# EAGLE design relay (EAGLE 9.6.2)
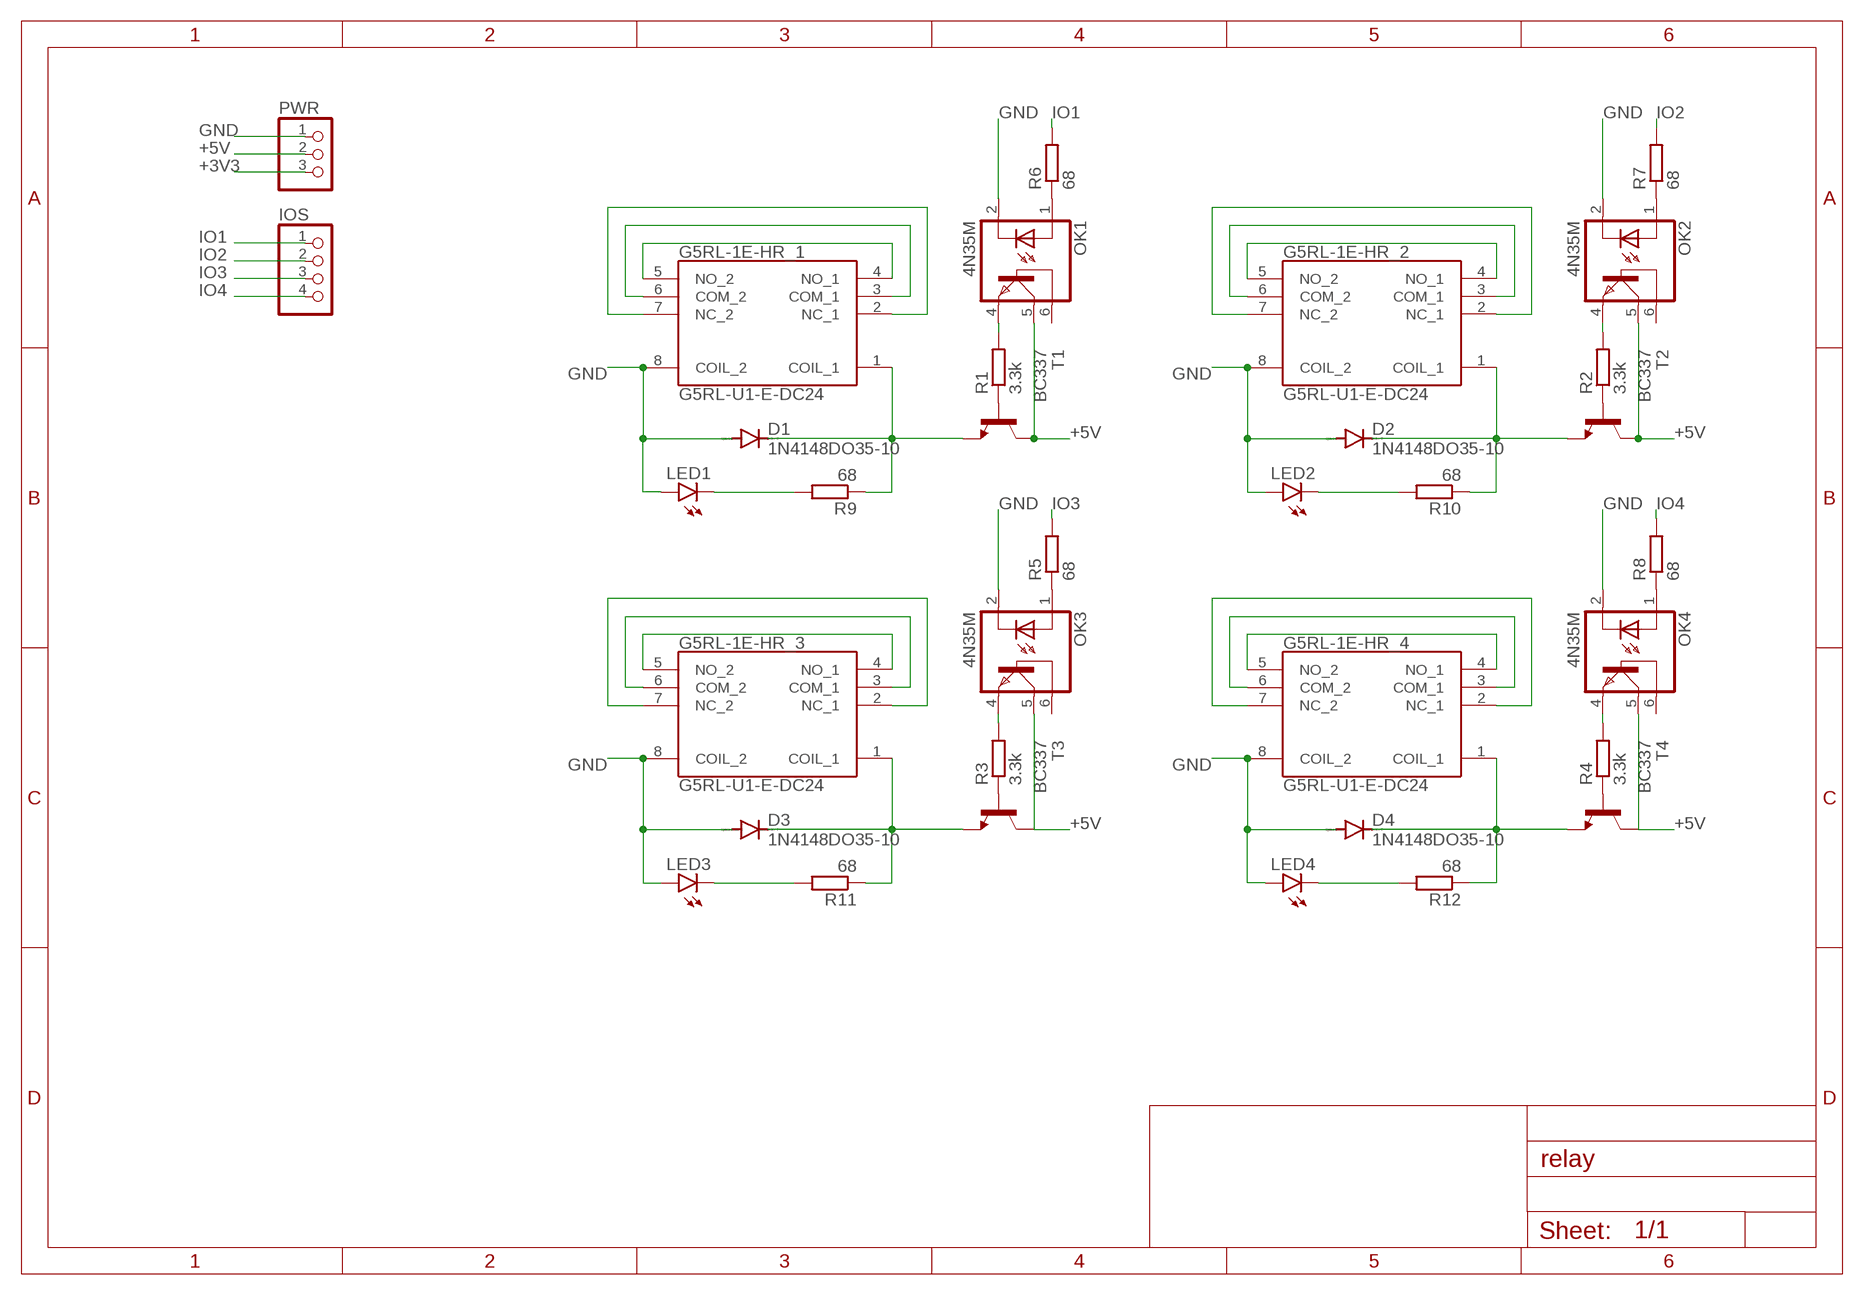
[diagram p0: schematic, sheet 1]

## Parts
D1  1N4148DO35-10  [DO35-10]
D2  1N4148DO35-10  [DO35-10]
D3  1N4148DO35-10  [DO35-10]
D4  1N4148DO35-10  [DO35-10]
G5RL-1E-HR_1  G5RL-U1-E-DC24  [G5RLU1EDC24]
G5RL-1E-HR_2  G5RL-U1-E-DC24  [G5RLU1EDC24]
G5RL-1E-HR_3  G5RL-U1-E-DC24  [G5RLU1EDC24]
G5RL-1E-HR_4  G5RL-U1-E-DC24  [G5RLU1EDC24]
IOS  PINHD-1X4  [1X04]
LED1  LED3MM  [LED3MM]
LED2  LED3MM  [LED3MM]
LED3  LED3MM  [LED3MM]
LED4  LED3MM  [LED3MM]
OK1  4N35M  [DIL06]
OK2  4N35M  [DIL06]
OK3  4N35M  [DIL06]
OK4  4N35M  [DIL06]
PWR  PINHD-1X3  [1X03]
R1  3.3k  R-EU_0207/7  [0207/7]
R2  3.3k  R-EU_0207/7  [0207/7]
R3  3.3k  R-EU_0207/7  [0207/7]
R4  3.3k  R-EU_0207/7  [0207/7]
R5  68  R-EU_0204/7  [0204/7]
R6  68  R-EU_0204/7  [0204/7]
R7  68  R-EU_0204/7  [0204/7]
R8  68  R-EU_0204/7  [0204/7]
R9  68  R-EU_0204/7  [0204/7]
R10  68  R-EU_0204/7  [0204/7]
R11  68  R-EU_0204/7  [0204/7]
R12  68  R-EU_0204/7  [0204/7]
T1  BC337  [TO92@1]
T2  BC337  [TO92@1]
T3  BC337  [TO92@1]
T4  BC337  [TO92@1]

## Nets
+3V3: PWR.3
+5V: OK1.5(COL) OK2.5(COL) OK3.5(COL) OK4.5(COL) PWR.2 T1.3(C) T2.3(C) T3.3(C) T4.3(C)
GND: D1.A D2.A D3.A D4.A G5RL-1E-HR_1.8(COIL_2) G5RL-1E-HR_2.8(COIL_2) G5RL-1E-HR_3.8(COIL_2) G5RL-1E-HR_4.8(COIL_2) LED1.A LED2.A LED3.A LED4.A OK1.2(C) OK2.2(C) OK3.2(C) OK4.2(C) PWR.1
IO1: IOS.1 R6.2
IO2: IOS.2 R7.2
IO3: IOS.3 R5.2
IO4: IOS.4 R8.2
N$1: G5RL-1E-HR_1.4(NO_1) G5RL-1E-HR_1.5(NO_2)
N$2: G5RL-1E-HR_1.3(COM_1) G5RL-1E-HR_1.6(COM_2)
N$3: G5RL-1E-HR_1.2(NC_1) G5RL-1E-HR_1.7(NC_2)
N$4: OK1.4(EMI) R1.2
N$5: D1.C G5RL-1E-HR_1.1(COIL_1) R9.1 T1.1(E)
N$6: R1.1 T1.2(B)
N$7: G5RL-1E-HR_2.4(NO_1) G5RL-1E-HR_2.5(NO_2)
N$8: G5RL-1E-HR_2.3(COM_1) G5RL-1E-HR_2.6(COM_2)
N$9: G5RL-1E-HR_2.2(NC_1) G5RL-1E-HR_2.7(NC_2)
N$10: OK1.1(A) R6.1
N$11: D2.C G5RL-1E-HR_2.1(COIL_1) R10.1 T2.1(E)
N$12: R2.1 T2.2(B)
N$13: G5RL-1E-HR_3.4(NO_1) G5RL-1E-HR_3.5(NO_2)
N$14: G5RL-1E-HR_3.3(COM_1) G5RL-1E-HR_3.6(COM_2)
N$15: G5RL-1E-HR_3.2(NC_1) G5RL-1E-HR_3.7(NC_2)
N$16: OK3.4(EMI) R3.2
N$17: D3.C G5RL-1E-HR_3.1(COIL_1) R11.1 T3.1(E)
N$18: R3.1 T3.2(B)
N$19: G5RL-1E-HR_4.4(NO_1) G5RL-1E-HR_4.5(NO_2)
N$20: G5RL-1E-HR_4.3(COM_1) G5RL-1E-HR_4.6(COM_2)
N$21: G5RL-1E-HR_4.2(NC_1) G5RL-1E-HR_4.7(NC_2)
N$22: OK3.1(A) R5.1
N$23: D4.C G5RL-1E-HR_4.1(COIL_1) R12.1 T4.1(E)
N$24: R4.1 T4.2(B)
N$25: OK4.4(EMI) R4.2
N$26: OK2.4(EMI) R2.2
N$27: OK2.1(A) R7.1
N$28: OK4.1(A) R8.1
N$29: LED1.K(C) R9.2
N$30: LED3.K(C) R11.2
N$31: LED2.K(C) R10.2
N$32: LED4.K(C) R12.2
Unconnected: OK1.6(BAS) OK2.6(BAS) OK3.6(BAS) OK4.6(BAS)

## Library data of the parts
D1-D4 = diode:1N4148: DIODE high speed (Philips)
G5RL-1E-HR_1-G5RL-1E-HR_4 = G5RL-U1-E-DC24:G5RL-U1-E-DC24: General Purpose Relays 16A hi swtch curent latching relay Source: Datasheet <https://componentsearchengine.com/Datasheets/1/G5RL-U1-E-DC24.pdf>; DESCRIPTION: General Purpose Relays 16A hi swtch curent latching relay; HEIGHT: 15.7mm; MANUFACTURER_NAME: Omron Electronics; MANUFACTURER_PART_NUMBER: G5RL-U1-E-DC24; MOUSER_PART_NUMBER: 653-G5RLU1EDC24; MOUSER_PRICE-STOCK: https://www.mouser.co.uk/ProductDetail/Omron-Electronics/G5RL-U1-E-DC24?qs=9CM3gX%252B2VGFmWjTQsGY23w%3D%3D
IOS = pinhead:PINHD-1X4: PIN HEADER
LED1-LED4 = led:LED: LED OSRAM: - CHIPLED LG R971, LG N971, LY N971, LG Q971, LY Q971, LO R971, LY R971 LH N974, LH R974 LS Q976, LO Q976, LY Q976 LO Q996 - Hyper CHIPLED LW Q18S LB Q993, LB Q99A, LB R99A - SideLED LS A670, LO A670, LY A670, LG A670, LP A670 LB A673, LV A673, LT A673, LW A673 LH A674 LY A675 LS A676, LA A676, LO A676, LY A676, LW A676 LS A679, LY A679, LG A679 - Hyper Micro SIDELED® LS Y876, LA Y876, LO Y876, LY Y876 LT Y87S - SmartLED LW L88C, LW L88S LB L89C, LB L89S, LG L890 LS L89K, LO L89K, LY L89K LS L896, LA L896, LO L896, LY L896 - TOPLED LS T670, LO T670, LY T670, LG T670, LP T670 LSG T670, LSP T670, LSY T670, LOP T670, LYG T670 LG T671, LOG T671, LSG T671 LB T673, LV T673, LT T673, LW T673 LH T674 LS T676, LA T676, LO T676, LY T676, LB T676, LH T676, LSB T676, LW T676 LB T67C, LV T67C, LT T67C, LS T67K, LO T67K, LY T67K, LW E67C LS E67B, LA E67B, LO E67B, LY E67B, LB E67C, LV E67C, LT E67C LW T67C LS T679, LY T679, LG T679 LS T770, LO T770, LY T770, LG T770, LP T770 LB T773, LV T773, LT T773, LW T773 LH T774 LS E675, LA E675, LY E675, LS T675 LS T776, LA T776, LO T776, LY T776, LB T776 LHGB T686 LT T68C, LB T68C - Hyper Mini TOPLED® LB M676 - Mini TOPLED Santana® LG M470 LS M47K, LO M47K, LY M47K Source: http://www.osram.convergy.de LUXEON: - LUMILED® LXK2-PW12-R00, LXK2-PW12-S00, LXK2-PW14-U00, LXK2-PW14-V00 LXK2-PM12-R00, LXK2-PM12-S00, LXK2-PM14-U00 LXK2-PE12-Q00, LXK2-PE12-R00, LXK2-PE12-S00, LXK2-PE14-T00, LXK2-PE14-U00 LXK2-PB12-K00, LXK2-PB12-L00, LXK2-PB12-M00, LXK2-PB14-N00, LXK2-PB14-P00, LXK2-PB14-Q00 LXK2-PR12-L00, LXK2-PR12-M00, LXK2-PR14-Q00, LXK2-PR14-R00 LXK2-PD12-Q00, LXK2-PD12-R00, LXK2-PD12-S00 LXK2-PH12-R00, LXK2-PH12-S00 LXK2-PL12-P00, LXK2-PL12-Q00, LXK2-PL12-R00 Source: www.luxeon.com KINGBRIGHT: KA-3528ASYC Source: www.kingbright.com
OK1-OK4 = optocoupler:4N*?M: General Purpose 6-Pin Phototransistor Optocouplers Source: http://www.fairchildsemi.com/ds/4N/4N35-M.pdf; MPN: 4N35-M; OC_FARNELL: 1021351; OC_NEWARK: 98K9114
PWR = pinhead:PINHD-1X3: PIN HEADER
R1-R12 = resistor:R-EU_: RESISTOR, European symbol
T1-T4 = transistor:BC337: NPN TRANSISTOR

## Board
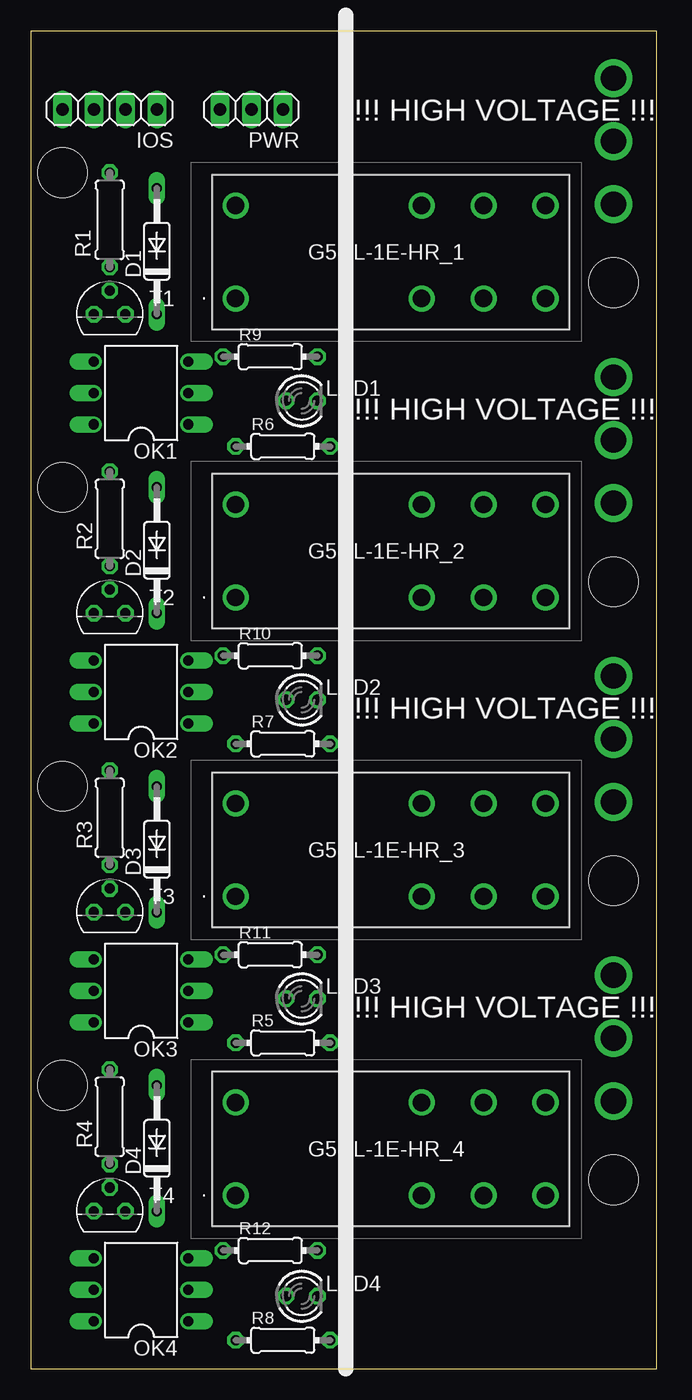
[diagram p1: board, top side]
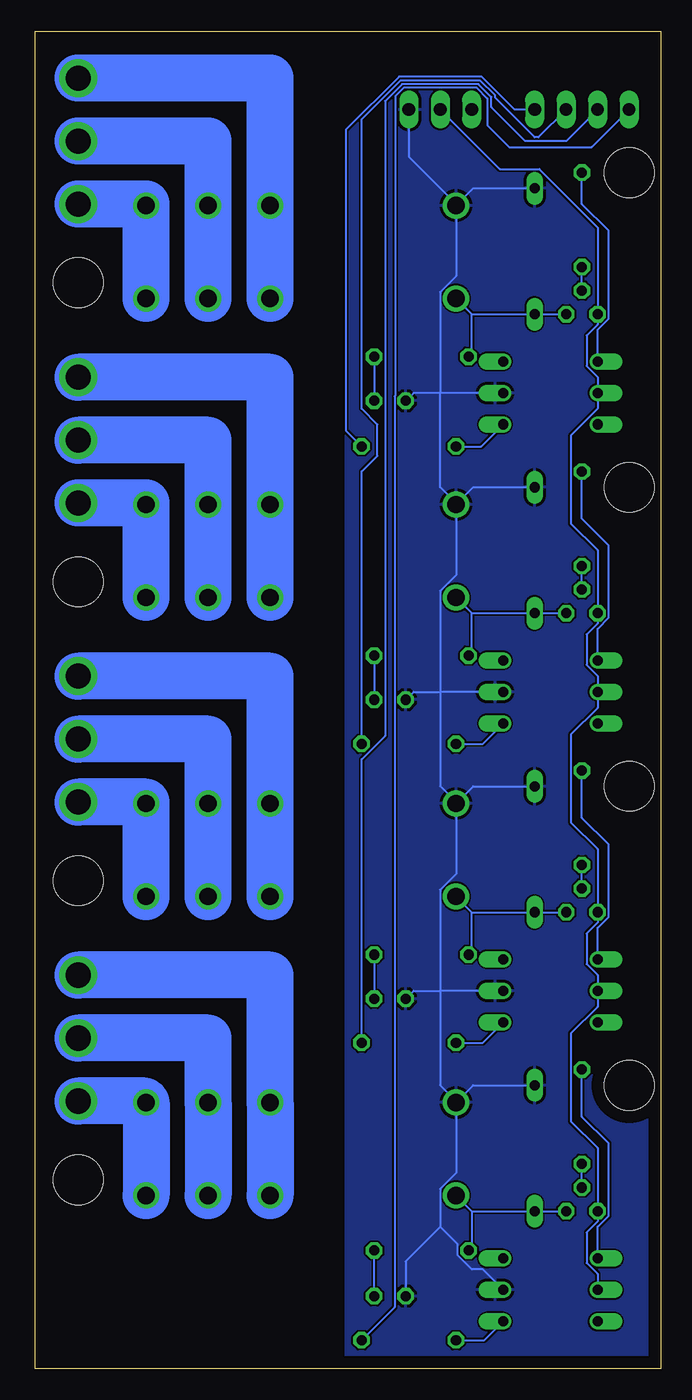
[diagram p2: board, bottom side, seen from below]

Size 50.47 x 107.94 mm. Coordinates in mm from the lower left corner, seen from the top.
Outline: 0,0 50.47,0 50.47,107.94 0,107.94 0,0
Copper layers (1*16): Top 0.035mm / dielectric 1.5mm / Bottom 0.035mm
Design rules "default": minimum track width 6mil, minimum drill 0.35mm, track to track 6mil, track to pad 6mil, pad to pad 6mil, via to via 6mil, smd to smd 6mil, copper to edge 40mil, drill to drill 6mil, minimum pad ring 10mil, minimum via ring 8mil, stop-mask expansion 4mil, vias tented up to drill 0mil, thermal gap 10mil
Holes 4 mm at 46.99,87.63 46.99,63.5 46.99,39.37 46.99,15.24 2.54,71.12 2.54,46.99 2.54,22.86 2.54,96.52

### Footprints (pad centres in the part's own frame; a part is rotated, then mirrored left to right if it is on the bottom)
DO35-10 = drill 0.813 long: A 5.08,0; C -5.08,0
G5RLU1EDC24 = drill 1.4 pad 2.1: 1 0,0; 2 15,0; 3 20,0; 4 25,0; 5 25,7.5; 6 20,7.5; 7 15,7.5; 8 0,7.5
1X04 = drill 1.016 long: 1 -3.81,0; 2 -1.27,0; 3 1.27,0; 4 3.81,0
LED3MM = drill 0.813 octagon: A -1.27,0; K 1.27,0
DIL06 = drill 0.813 offset: 1 -2.54,-3.81; 2 0,-3.81; 3 2.54,-3.81; 4 2.54,3.81; 5 0,3.81; 6 -2.54,3.81
1X03 = drill 1.016 long: 1 -2.54,0; 2 0,0; 3 2.54,0
0207/7 = drill 0.813 octagon: 1 -3.81,0; 2 3.81,0
0204/7 = drill 0.813 octagon: 1 -3.81,0; 2 3.81,0
TO92@1 = drill 0.813 octagon: 1 1.27,0; 2 0,1.905; 3 -1.27,0

### Placement (x,y rotation side)
D1  10.16,90.17 90 top
D2  10.16,66.04 90 top
D3  10.16,41.91 90 top
D4  10.16,17.78 90 top
G5RL-1E-HR_1  16.51,86.36 0 top
G5RL-1E-HR_2  16.51,62.23 0 top
G5RL-1E-HR_3  16.51,38.1 0 top
G5RL-1E-HR_4  16.51,13.97 0 top
IOS  6.35,101.6 180 top
LED1  21.84,78.11 0 top
LED2  21.84,53.98 0 top
LED3  21.84,29.84 0 top
LED4  21.84,5.84 0 top
OK1  8.89,78.74 90 top
OK2  8.89,54.61 90 top
OK3  8.89,30.48 90 top
OK4  8.89,6.35 90 top
PWR  17.78,101.6 180 top
R1  6.35,92.71 90 top
R2  6.35,68.58 90 top
R3  6.35,44.45 90 top
R4  6.35,20.32 90 top
R5  20.32,26.29 0 top
R6  20.32,74.42 0 top
R7  20.32,50.42 0 top
R8  20.32,2.29 0 top
R9  19.3,81.66 0 top
R10  19.3,57.53 0 top
R11  19.3,33.4 0 top
R12  19.3,9.53 0 top
T1  6.35,85.09 0 top
T2  6.35,60.96 0 top
T3  6.35,36.83 0 top
T4  6.35,12.7 0 top

### Tracks (layer width: path | path; a pad name or v marks a point on that pad's centre or on a via)
+5V
  Bottom 0.152: OK4.5 5.08,7.63 5.97,8.52 5.97,10.99 5.08,11.87 T4.3 5.08,17.79 7.24,19.95 7.24,27.04 5.08,29.2 OK3.5 5.08,31.76 5.97,32.65 5.97,35.12 5.08,36 T3.3 5.08,41.92 7.24,44.08 7.24,51.17 5.08,53.33 OK2.5 5.08,55.89 5.97,56.78 5.97,59.24 5.08,60.13 T2.3 5.08,66.05 7.24,68.21 7.24,75.3 5.08,77.46 OK1.5 5.08,80.02 5.97,80.91 5.97,83.38 5.08,84.26 T1.3 5.08,92.09 9.79,96.8 12.98,96.8 PWR.2
GND
  Bottom 0.152: 16.45,93.92 G5RL-1E-HR_1.8 16.51,88.17 17.79,86.89 17.79,78.74 | 16.45,93.92 15.12,95.25 D1.A | 16.45,69.79 G5RL-1E-HR_2.8 16.51,64.04 17.79,62.76 17.79,54.61 | 16.45,69.79 15.12,71.12 D2.A | 16.45,45.66 G5RL-1E-HR_3.8 16.51,39.91 17.79,38.63 17.79,30.48 | 16.45,45.66 15.12,46.99 D3.A | 16.45,21.53 G5RL-1E-HR_4.8 16.51,15.78 17.79,14.5 17.79,11.43 | 16.45,21.53 15.12,22.86 D4.A | PWR.1 20.32,97.79 16.45,93.92 | 17.79,78.74 17.79,71.13 16.45,69.79 | 17.79,54.61 17.79,47 16.45,45.66 | OK1.2 17.79,78.74 | OK2.2 17.79,54.61 | OK3.2 17.79,30.48 | 17.79,11.43 17.79,11.4 | 17.79,78.74 19.94,78.74 LED1.A | LED2.A 19.94,54.61 17.79,54.61 | OK4.2 14.35,8 15.23,8 16.38,9.16 16.38,10.02 17.79,11.43 | 17.79,11.43 20.57,8.64 LED4.A | LED3.A 19.94,30.48 17.79,30.48 | 16.45,21.53 17.79,22.87 17.79,30.48
  pour Bottom: 0,107.95 0,0 25.4,0 25.4,107.95
IO1
  Bottom 0.152: IOS.1 11.78,101.6 14.45,104.27 21.11,104.27 25.4,99.98 25.4,75.69 R6.2
IO2
  Bottom 0.152: IOS.2 9.86,99.37 10.16,99.37 13.36,102.57 13.36,102.75 14.58,103.96 20.98,103.96 24.13,100.82 24.13,77.47 22.86,76.2 22.86,73.66 24.13,72.39 R7.2
IO3
  Bottom 0.152: IOS.3 7.62,99.06 10.92,99.06 13.66,101.8 13.66,102.62 14.7,103.66 20.86,103.66 22.22,102.29 22.22,51.07 24.13,49.16 R5.2
IO4
  Bottom 0.152: IOS.4 5.56,98.58 12.22,98.58 13.97,100.33 13.97,102.49 14.83,103.35 20.73,103.35 21.4,102.68 21.4,78.54 21.46,78.47 21.46,4.95 R8.2
N$1  (via drill 2.03)
  Bottom 3.81: G5RL-1E-HR_1.4 G5RL-1E-HR_1.5 41.51,93.98 v46.99,93.98
N$2  (via drill 2.03)
  Bottom 3.81: G5RL-1E-HR_1.3 G5RL-1E-HR_1.6 36.51,99.06 v46.99,99.06
N$3  (via drill 2.03)
  Bottom 3.81: G5RL-1E-HR_1.2 G5RL-1E-HR_1.7 31.51,104.14 v46.99,104.14
N$4
  Bottom 0.152: OK1.4 5.08,83.83 4.19,84.72 4.19,91.82 6.35,93.98 R1.2
N$5
  Bottom 0.152: G5RL-1E-HR_1.1 15.24,85.09 | 15.24,85.09 D1.C T1.1 | R9.1 15.24,81.92 15.24,85.09
N$6
  Bottom 0.152: T1.2 R1.1
N$7  (via drill 2.03)
  Bottom 3.81: G5RL-1E-HR_2.4 G5RL-1E-HR_2.5 41.51,69.85 v46.99,69.85
N$8  (via drill 2.03)
  Bottom 3.81: G5RL-1E-HR_2.3 G5RL-1E-HR_2.6 36.51,74.93 v46.99,74.93
N$9  (via drill 2.03)
  Bottom 3.81: G5RL-1E-HR_2.2 G5RL-1E-HR_2.7 31.51,80.01 v46.99,80.01
N$10
  Bottom 0.152: R6.1 14.48,74.42 OK1.1
N$11
  Bottom 0.152: G5RL-1E-HR_2.1 15.24,60.96 | 15.24,60.96 D2.C T2.1 | R10.1 15.24,57.79 15.24,60.96
N$12
  Bottom 0.152: T2.2 R2.1
N$13  (via drill 2.03)
  Bottom 3.81: G5RL-1E-HR_3.4 G5RL-1E-HR_3.5 41.51,45.72 v46.99,45.72
N$14  (via drill 2.03)
  Bottom 3.81: G5RL-1E-HR_3.3 G5RL-1E-HR_3.6 36.51,50.8 v46.99,50.8
N$15  (via drill 2.03)
  Bottom 3.81: G5RL-1E-HR_3.2 G5RL-1E-HR_3.7 31.51,55.88 v46.99,55.88
N$16
  Bottom 0.152: OK3.4 5.08,35.57 4.19,36.46 4.19,42.29 6.35,44.45 R3.2
N$17
  Bottom 0.152: G5RL-1E-HR_3.1 15.24,36.83 | 15.24,36.83 D3.C T3.1 | R11.1 15.24,33.66 15.24,36.83
N$18
  Bottom 0.152: T3.2 R3.1
N$19  (via drill 2.03)
  Bottom 3.81: G5RL-1E-HR_4.4 G5RL-1E-HR_4.5 41.63,21.59 v46.99,21.59
N$20  (via drill 2.03)
  Bottom 3.81: G5RL-1E-HR_4.3 G5RL-1E-HR_4.6 36.51,26.67 v46.99,26.67
N$21  (via drill 2.03)
  Bottom 3.81: G5RL-1E-HR_4.2 G5RL-1E-HR_4.7 31.51,31.75 v46.99,31.75
N$22
  Bottom 0.152: R5.1 14.35,26.29 OK3.1
N$23
  Bottom 0.152: G5RL-1E-HR_4.1 15.24,12.7 | 15.24,12.7 D4.C T4.1 | 15.24,12.7 15.24,9.78 R12.1
N$24
  Bottom 0.152: T4.2 R4.1
N$25
  Bottom 0.152: OK4.4 5.08,11.44 4.19,12.33 4.19,18.16 6.35,20.32 R4.2
N$26
  Bottom 0.152: OK2.4 5.08,59.7 4.19,60.59 4.19,66.42 6.35,68.58 R2.2
N$27
  Bottom 0.152: R7.1 14.35,50.42 OK2.1
N$28
  Bottom 0.152: R8.1 14.22,2.29 OK4.1
N$29
  Bottom 0.152: R9.2 LED1.K
N$30
  Bottom 0.152: R11.2 LED3.K
N$31
  Bottom 0.152: R10.2 LED2.K
N$32
  Bottom 0.152: LED4.K R12.2

### Text on the board
tNames: !!! HIGH VOLTAGE !!! | !!! HIGH VOLTAGE !!! | !!! HIGH VOLTAGE !!! | !!! HIGH VOLTAGE !!!